# EAGLE design busunit (EAGLE 8.0.2)
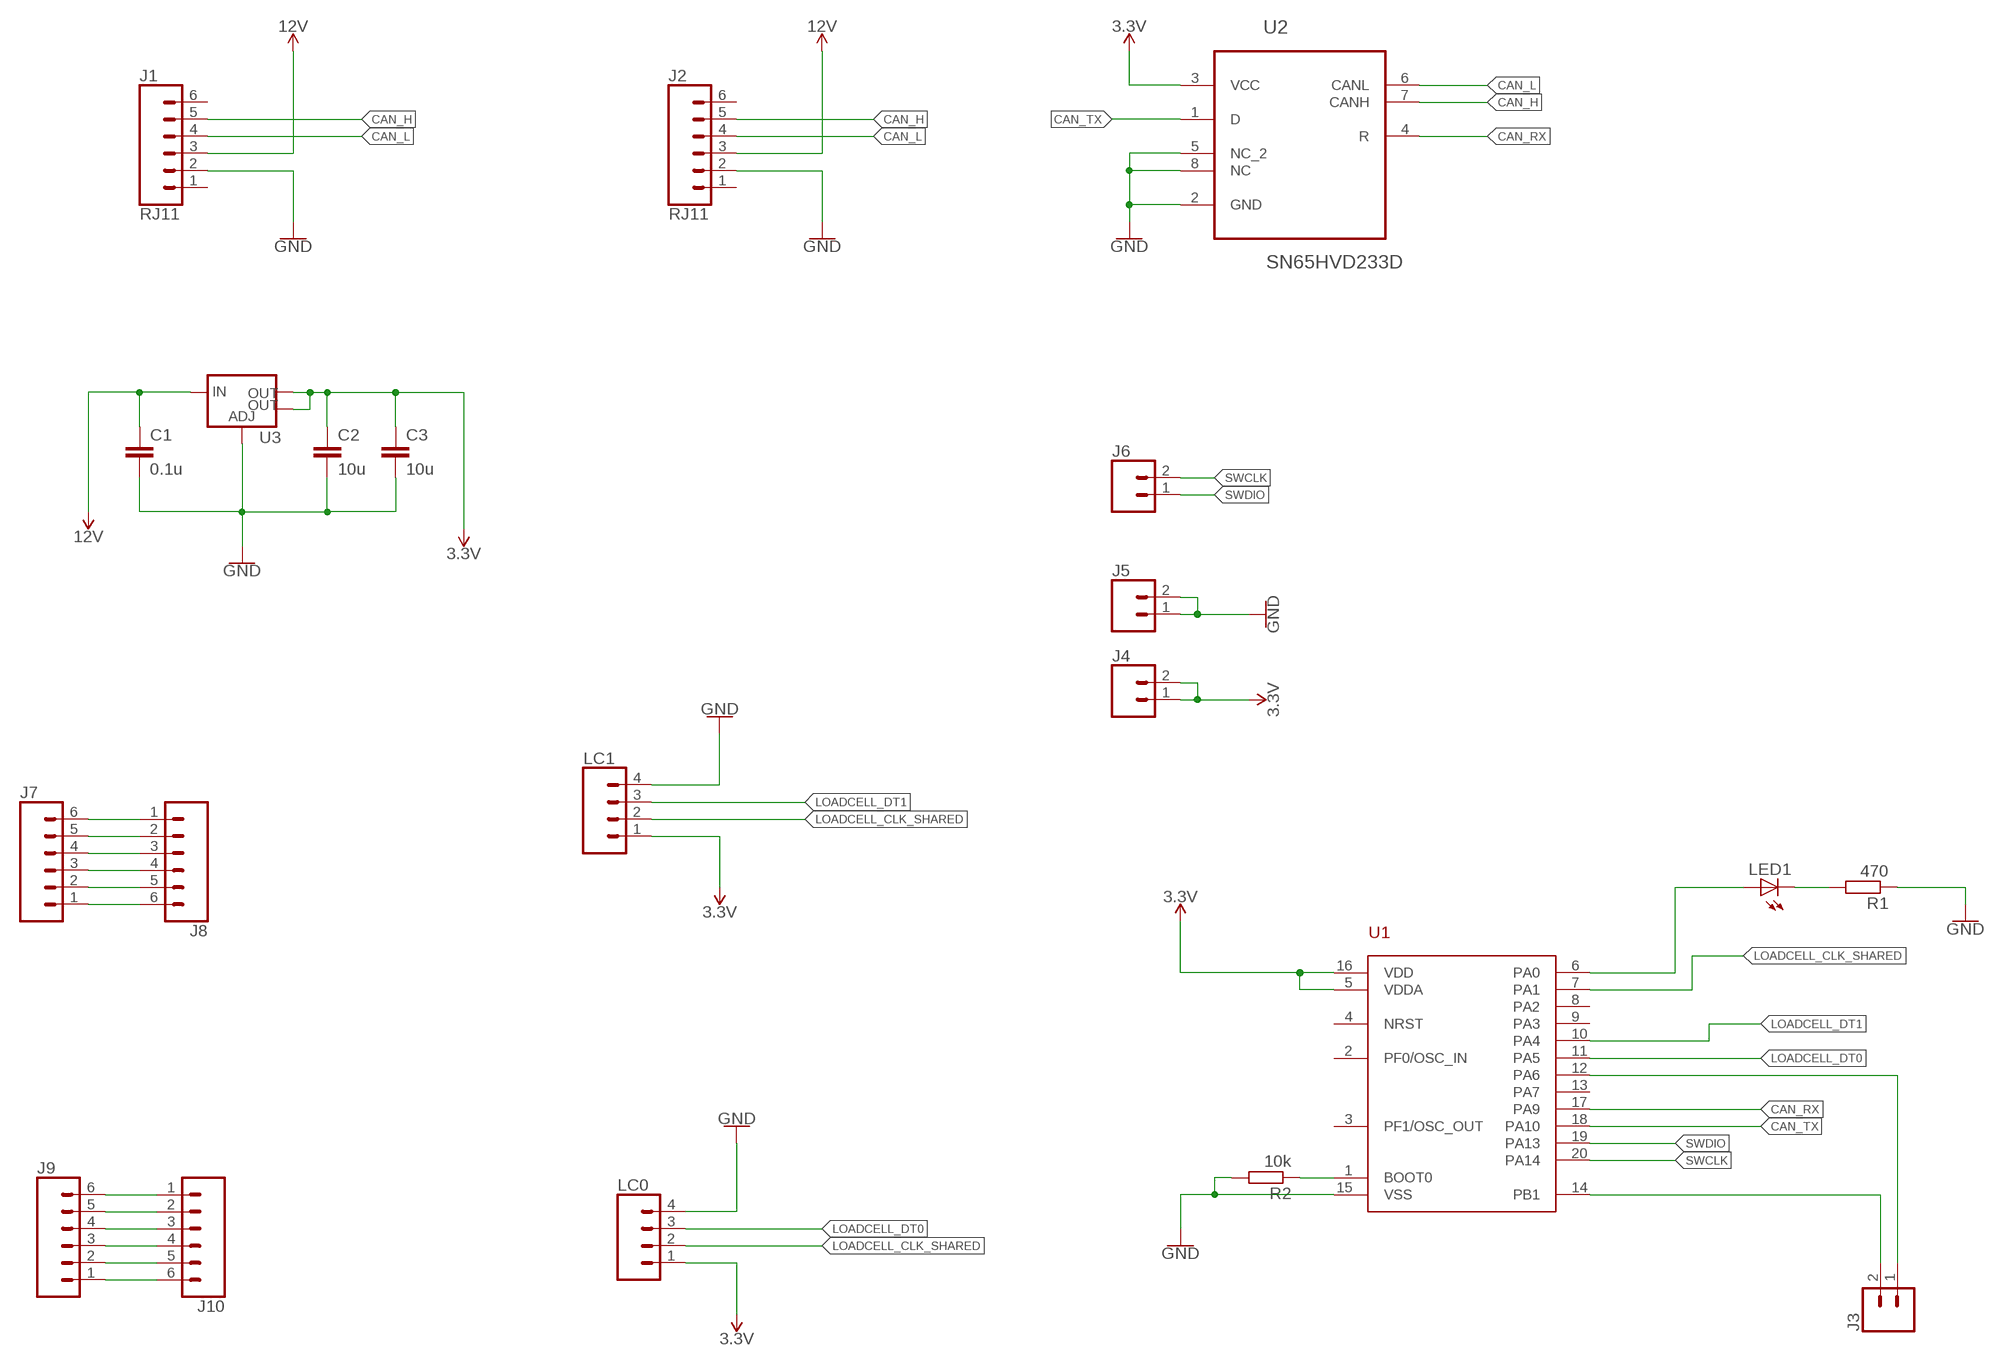
[diagram p0: schematic, sheet 1]

## Parts
C1  0.1u  C-EUC1206K  [C1206K]
C2  10u  C-EUC1206K  [C1206K]
C3  10u  C-EUC1206K  [C1206K]
J1  RJ11  RJ11-6  [RJ11-6]
J2  RJ11  RJ11-6  [RJ11-6]
J3  CONN_02  [1X02]
J4  CONN_02  [1X02]
J5  CONN_02  [1X02]
J6  CONN_02  [1X02]
J7  CONN_06SILK_FEMALE_PTH  [1X06]
J8  CONN_06SILK_FEMALE_PTH  [1X06]
J9  CONN_06SILK_FEMALE_PTH  [1X06]
J10  CONN_06SILK_FEMALE_PTH  [1X06]
LC0  CONN_04  [1X04]
LC1  CONN_04  [1X04]
LED1  LEDCHIPLED_1206  [CHIPLED_1206]
R1  470  R-EU_R1206  [R1206]
R2  10k  R-EU_R1206  [R1206]
U1  STM32F030F4  [TSSOP20]
U2  SN65HVD233D  [SOIC127P600X175-8N]
U3  V_REG_LM1117SOT223  [SOT223]

## Nets
3.3V: C2.1 C3.1 J4.1 J4.2 LC0.1 LC1.1 U1.5(VDDA) U1.16(VDD) U2.3(VCC) U3.2(OUT) U3.4(OUT)
12V: C1.1 J1.3 J2.3 U3.3(IN)
CAN_H: J1.5 J2.5 U2.7(CANH)
CAN_L: J1.4 J2.4 U2.6(CANL)
CAN_RX: U1.17(PA9) U2.4(R)
CAN_TX: U1.18(PA10) U2.1(D)
GND: C1.2 C2.2 C3.2 J1.2 J2.2 J5.1 J5.2 LC0.4 LC1.4 R1.1 R2.2 U1.15(VSS) U2.2(GND) U2.5(NC_2) U2.8(NC) U3.1(ADJ)
LED: LED1.A U1.6(PA0)
LOADCELL_CLK_SHARED: LC0.2 LC1.2 U1.7(PA1)
LOADCELL_DT0: LC0.3 U1.11(PA5)
LOADCELL_DT1: LC1.3 U1.10(PA4)
N$2: R2.1 U1.1(BOOT0)
N$3: LED1.C R1.2
N$4: J9.6 J10.1
N$5: J9.5 J10.2
N$6: J9.4 J10.3
N$7: J9.3 J10.4
N$8: J9.2 J10.5
N$9: J9.1 J10.6
N$10: J7.1 J8.6
N$11: J7.2 J8.5
N$12: J7.3 J8.4
N$13: J7.4 J8.3
N$14: J7.5 J8.2
N$15: J7.6 J8.1
PA6: J3.1 U1.12(PA6)
PB1: J3.2 U1.14(PB1)
SWCLK: J6.2 U1.20(PA14)
SWDIO: J6.1 U1.19(PA13)
Unconnected: J1.1 J1.6 J2.1 J2.6 U1.2(PF0/OSC_IN) U1.3(PF1/OSC_OUT) U1.4(NRST) U1.8(PA2) U1.9(PA3) U1.13(PA7)

## Library data of the parts
C1-C3 = rcl:C-EU: CAPACITOR, European symbol
J1 J2 = SparkFun-Connectors:RJ11-6: RJ11 Jack - 6 pin Commonly found on CAT3 devices and some Microchip programmers. Here is the connector we sell at SparkFun: RJ11 6-Pin Connector <https://www.sparkfun.com/products/132> (PRT-00132) Datasheet <http://www.sparkfun.com/datasheets/Prototyping/Connectors/RJ11-Datasheet.pdf> It is used on this SparkFun product: SparkFun Weather Shield <https://www.sparkfun.com/products/12081> (DEV-12081) Weather Meters <https://www.sparkfun.com/products/8942> (SEN-08942); PROD_ID: CONN-08590; SF_ID: PRT-00132
J3-J6 = SparkFun-Connectors:CONN_02: Multi connection point. Often used as Generic Header-pin footprint for 0.1 inch spaced/style header connections On any of the 0.1 inch spaced packages, you can populate with these: Break Away Headers - Straight <https://www.sparkfun.com/products/116> (PRT-00116) Break Away Male Headers - Right Angle <https://www.sparkfun.com/products/553> (PRT-00553) Female Headers <https://www.sparkfun.com/products/115> (PRT-00115) Break Away Headers - Machine Pin <https://www.sparkfun.com/products/117> (PRT-00117) Break Away Female Headers - Swiss Machine Pin <https://www.sparkfun.com/products/743> (PRT-00743) For SCREWTERMINALS and SPRING TERMINALS visit here: Screw Terimnals on SparkFun.com <https://www.sparkfun.com/search/results?term=Screw+Terminals> (5mm/3.5mm/2.54mm spacing) This device is also useful as a general connection point to wire up your design to another part of your project. Our various solder wires solder well into these plated through hole pads. Hook-Up Wire - Assortment (Stranded, 22 AWG) <https://www.sparkfun.com/products/11375> (PRT-11375) Hook-Up Wire - Assortment (Solid Core, 22 AWG) <https://www.sparkfun.com/products/11367> (PRT-11367) View the entire wire category on our website here <https://www.sparkfun.com/categories/141> Special notes: Molex polarized connector foot print use with: PRT-08233 with associated crimp pins and housings. 2.54_SCREWTERM for use with PRT-10571. 3.5mm Screw Terminal footprints for PRT-08084 5mm Screw Terminal footprints for use with PRT-08432
J7-J10 = SparkFun-Connectors:CONN_06: Multi connection point. Often used as Generic Header-pin footprint for 0.1 inch spaced/style header connections On any of the 0.1 inch spaced packages, you can populate with these: Break Away Headers - Straight <https://www.sparkfun.com/products/116> (PRT-00116) Break Away Male Headers - Right Angle <https://www.sparkfun.com/products/553> (PRT-00553) Female Headers <https://www.sparkfun.com/products/115> (PRT-00115) Break Away Headers - Machine Pin <https://www.sparkfun.com/products/117> (PRT-00117) Break Away Female Headers - Swiss Machine Pin <https://www.sparkfun.com/products/743> (PRT-00743) Arduino Stackable Header - 6 Pin <https://www.sparkfun.com/products/9280> (PRT-09280) For SCREWTERMINALS and SPRING TERMINALS visit here: Screw Terimnals on SparkFun.com <https://www.sparkfun.com/search/results?term=Screw+Terminals> (5mm/3.5mm/2.54mm spacing) This device is also useful as a general connection point to wire up your design to another part of your project. Our various solder wires solder well into these plated through hole pads. Hook-Up Wire - Assortment (Stranded, 22 AWG) <https://www.sparkfun.com/products/11375> (PRT-11375) Hook-Up Wire - Assortment (Solid Core, 22 AWG) <https://www.sparkfun.com/products/11367> (PRT-11367) View the entire wire category on our website here <https://www.sparkfun.com/categories/141>; PROD_ID: CONN-08437
LC0 LC1 = SparkFun-Connectors:CONN_04: Multi connection point. Often used as Generic Header-pin footprint for 0.1 inch spaced/style header connections On any of the 0.1 inch spaced packages, you can populate with these: Break Away Headers - Straight <https://www.sparkfun.com/products/116> (PRT-00116) Break Away Male Headers - Right Angle <https://www.sparkfun.com/products/553> (PRT-00553) Female Headers <https://www.sparkfun.com/products/115> (PRT-00115) Break Away Headers - Machine Pin <https://www.sparkfun.com/products/117> (PRT-00117) Break Away Female Headers - Swiss Machine Pin <https://www.sparkfun.com/products/743> (PRT-00743) For SCREWTERMINALS and SPRING TERMINALS visit here: Screw Terimnals on SparkFun.com <https://www.sparkfun.com/search/results?term=Screw+Terminals> (5mm/3.5mm/2.54mm spacing) This device is also useful as a general connection point to wire up your design to another part of your project. Our various solder wires solder well into these plated through hole pads. Hook-Up Wire - Assortment (Stranded, 22 AWG) <https://www.sparkfun.com/products/11375> (PRT-11375) Hook-Up Wire - Assortment (Solid Core, 22 AWG) <https://www.sparkfun.com/products/11367> (PRT-11367) View the entire wire category on our website here <https://www.sparkfun.com/categories/141> Special notes: Molex polarized connector foot print use with SKU : PRT-08231 with associated crimp pins and housings. 1MM SMD Version SKU: PRT-10208; PROD_ID: CONN-09696
LED1 = led:LED: LED OSRAM: - CHIPLED LG R971, LG N971, LY N971, LG Q971, LY Q971, LO R971, LY R971 LH N974, LH R974 LS Q976, LO Q976, LY Q976 LO Q996 - Hyper CHIPLED LW Q18S LB Q993, LB Q99A, LB R99A - SideLED LS A670, LO A670, LY A670, LG A670, LP A670 LB A673, LV A673, LT A673, LW A673 LH A674 LY A675 LS A676, LA A676, LO A676, LY A676, LW A676 LS A679, LY A679, LG A679 - Hyper Micro SIDELED® LS Y876, LA Y876, LO Y876, LY Y876 LT Y87S - SmartLED LW L88C, LW L88S LB L89C, LB L89S, LG L890 LS L89K, LO L89K, LY L89K LS L896, LA L896, LO L896, LY L896 - TOPLED LS T670, LO T670, LY T670, LG T670, LP T670 LSG T670, LSP T670, LSY T670, LOP T670, LYG T670 LG T671, LOG T671, LSG T671 LB T673, LV T673, LT T673, LW T673 LH T674 LS T676, LA T676, LO T676, LY T676, LB T676, LH T676, LSB T676, LW T676 LB T67C, LV T67C, LT T67C, LS T67K, LO T67K, LY T67K, LW E67C LS E67B, LA E67B, LO E67B, LY E67B, LB E67C, LV E67C, LT E67C LW T67C LS T679, LY T679, LG T679 LS T770, LO T770, LY T770, LG T770, LP T770 LB T773, LV T773, LT T773, LW T773 LH T774 LS E675, LA E675, LY E675, LS T675 LS T776, LA T776, LO T776, LY T776, LB T776 LHGB T686 LT T68C, LB T68C - Hyper Mini TOPLED® LB M676 - Mini TOPLED Santana® LG M470 LS M47K, LO M47K, LY M47K Source: http://www.osram.convergy.de LUXEON: - LUMILED® LXK2-PW12-R00, LXK2-PW12-S00, LXK2-PW14-U00, LXK2-PW14-V00 LXK2-PM12-R00, LXK2-PM12-S00, LXK2-PM14-U00 LXK2-PE12-Q00, LXK2-PE12-R00, LXK2-PE12-S00, LXK2-PE14-T00, LXK2-PE14-U00 LXK2-PB12-K00, LXK2-PB12-L00, LXK2-PB12-M00, LXK2-PB14-N00, LXK2-PB14-P00, LXK2-PB14-Q00 LXK2-PR12-L00, LXK2-PR12-M00, LXK2-PR14-Q00, LXK2-PR14-R00 LXK2-PD12-Q00, LXK2-PD12-R00, LXK2-PD12-S00 LXK2-PH12-R00, LXK2-PH12-S00 LXK2-PL12-P00, LXK2-PL12-Q00, LXK2-PL12-R00 Source: www.luxeon.com KINGBRIGHT: KA-3528ASYC Source: www.kingbright.com
R1 R2 = rcl:R-EU_: RESISTOR, European symbol
U1 = stm32f030f4:STM32F030F4
U2 = Texas Instruments_By_element14_Batch_1:SN65HVD233D: 3.3-V CAN TRANSCEIVERS; MPN: SN65HVD233D; OC_FARNELL: 1207268; OC_NEWARK: 54H4289; PACKAGE: SOIC-8; SUPPLIER: Texas Instruments
U3 = SparkFun-IC-Power:V_REG_LM1117: Voltage Regulator LM1117 Standard adjustable voltage regulator but in SMD form. Spark Fun Electronics SKU : COM-00595; PROD_ID: VREG-08170

## Board
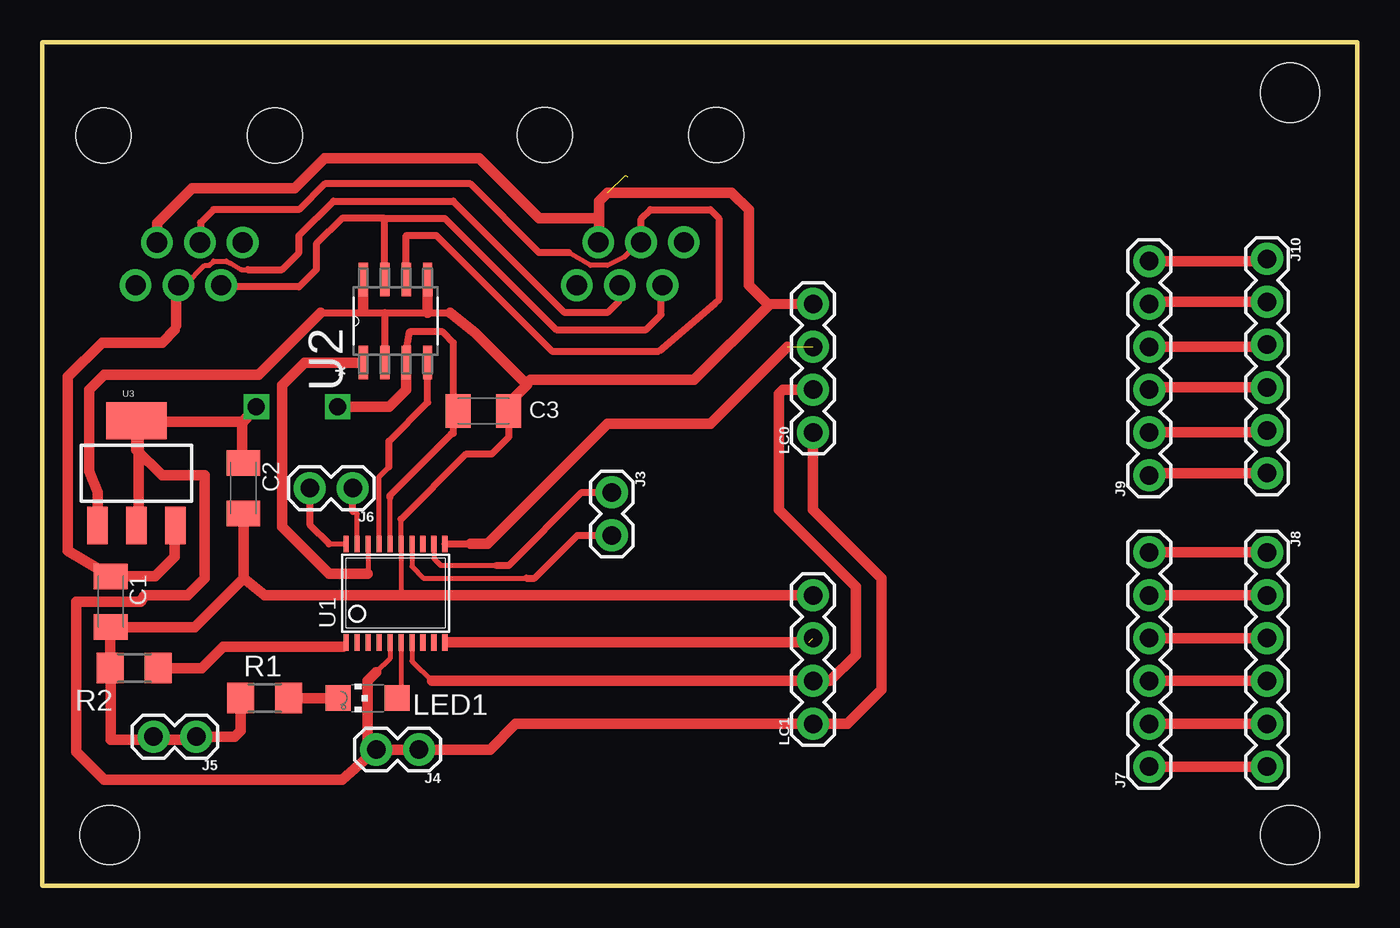
[diagram p1: board, top side]
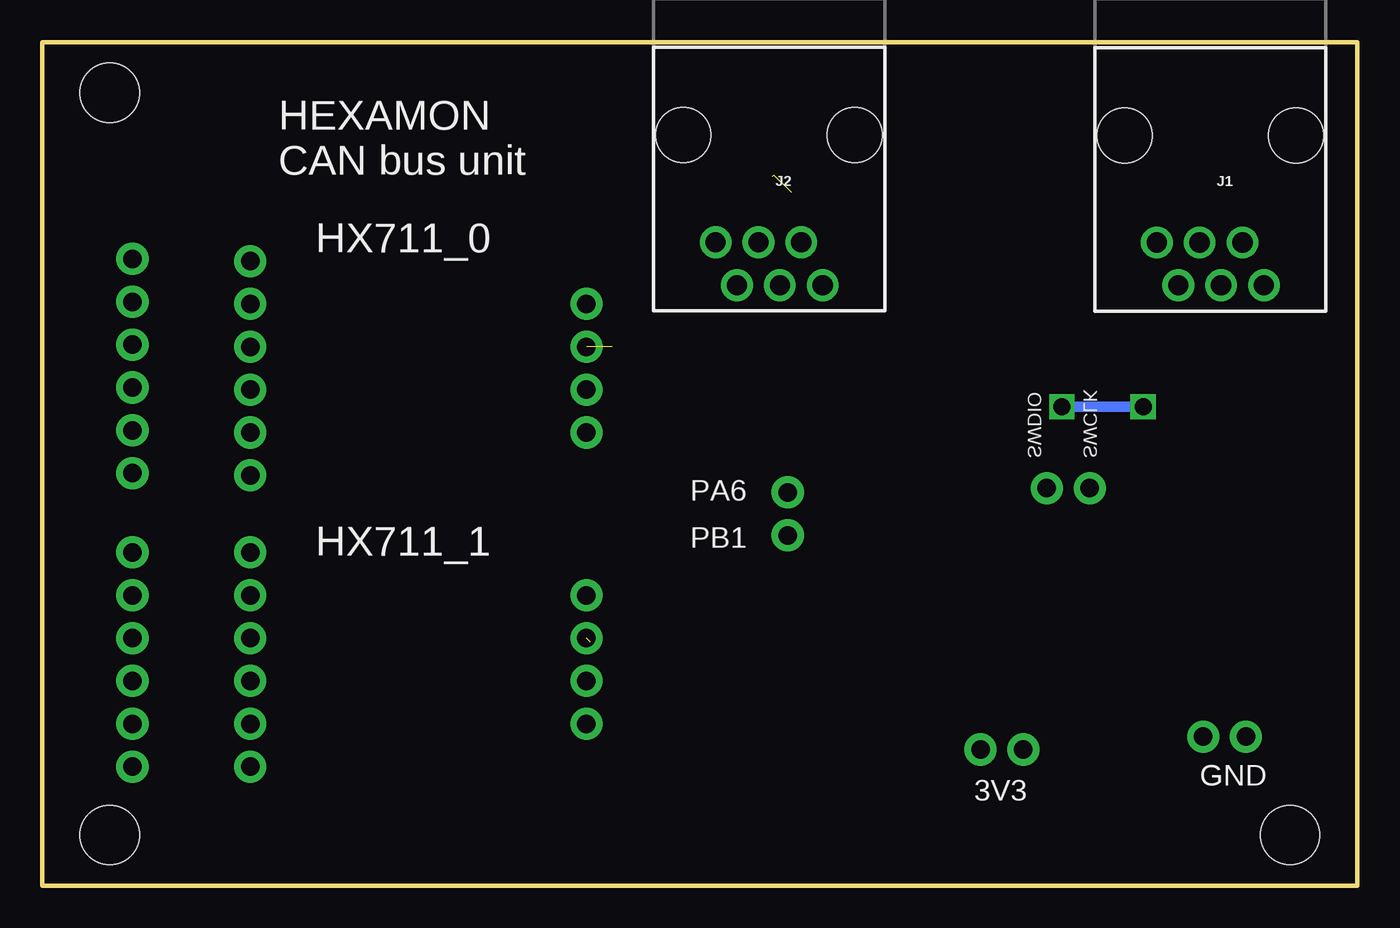
[diagram p2: board, bottom side, seen from below]

Size 78 x 50 mm. Coordinates in mm from the lower left corner, seen from the top.
Outline: 0,0 78,0 78,50 0,50 0,0
Copper layers (1*16): Top 0.035mm / dielectric 1.5mm / Bottom 0.035mm
Design rules "default": minimum track width 10mil, minimum drill 24mil, track to track 8mil, track to pad 8mil, pad to pad 8mil, via to via 8mil, smd to smd 8mil, copper to edge 40mil, drill to drill 8mil, minimum pad ring 10mil, minimum via ring 8mil, stop-mask expansion 4mil, vias tented up to drill 0mil, thermal gap 10mil
Holes 3.5 mm at 4,3 74,3 74,47

### Footprints (pad centres in the part's own frame; a part is rotated, then mirrored left to right if it is on the bottom)
C1206K = smd 1.5 x 2: 1 -1.5,0; 2 1.5,0
RJ11-6 = drill 1.2 pad 1.88: 1 -3.175,8.89; 2 -1.905,6.35; 3 -0.635,8.89; 4 0.635,6.35; 5 1.905,8.89; 6 3.175,6.35 | hole 3.25: -5.08,0; 5.08,0
1X02 = drill 1.1 pad 1.9: 1 0,0; 2 2.54,0
1X06 = drill 1.1 pad 1.9: 1 0,0; 2 2.54,0; 3 5.08,0; 4 7.62,0; 5 10.16,0; 6 12.7,0
1X04 = drill 1.1 pad 1.9: 1 0,0; 2 2.54,0; 3 5.08,0; 4 7.62,0
CHIPLED_1206 = smd 1.5 x 1.5: A 0,-1.75; C 0,1.75
R1206 = smd 1.6 x 1.803: 1 -1.422,0; 2 1.422,0
TSSOP20 = smd 0.305 x 0.991: 1 -2.925,-2.918; 2 -2.275,-2.918; 3 -1.625,-2.918; 4 -0.975,-2.918; 5 -0.325,-2.918; 6 0.325,-2.918; 7 0.975,-2.918; 8 1.625,-2.918; 9 2.275,-2.918; 10 2.925,-2.918; 11 2.925,2.918; 12 2.275,2.918; 13 1.625,2.918; 14 0.975,2.918; 15 0.325,2.918; 16 -0.325,2.918; 17 -0.975,2.918; 18 -1.625,2.918; 19 -2.275,2.918; 20 -2.925,2.918
SOIC127P600X175-8N = smd 1.981 x 0.559: 1 -2.464,1.905; 2 -2.464,0.635; 3 -2.464,-0.635; 4 -2.464,-1.905; 5 2.464,-1.905; 6 2.464,-0.635; 7 2.464,0.635; 8 2.464,1.905
SOT223 = smd 1.219 x 2.235: 1 -2.311,-3.099; 2 0,-3.099; 3 2.311,-3.099 | smd 3.6 x 2.2: 4 0,3.099

### Placement (x,y rotation side)
C1  4.06,16.83 270 top
C2  11.94,23.56 270 top
C3  26.16,28.13 0 top
J1  8.72,44.48 180 bottom
J2  34.88,44.48 180 bottom
J3  33.78,23.3 270 top
J4  22.35,8.06 180 top
J5  9.14,8.83 180 top
J6  18.41,23.56 180 top
J7  65.65,7.05 90 top
J8  72.64,19.75 270 top
J9  65.65,24.32 90 top
J10  72.64,37.15 270 top
LC0  45.72,26.86 90 top
LC1  45.72,9.59 90 top
LED1  19.3,11.11 90 top
R1  13.21,11.11 0 top
R2  5.46,12.89 180 top
U1  20.95,17.34 0 top
U2  20.95,33.46 90 top
U3  5.59,24.45 0 top

### Tracks (layer width: path | path; a pad name or v marks a point on that pad's centre or on a via)
3.3V  (via drill 1)
  Top 0.254: U2.3 21.59,31.62 | 20.64,20.51 U1.16 | 11.87,25.08 C2.1 | 5.71,21.46 U3.2 | 5.71,27.5 U3.4 | 20.64,14.16 U1.5 | 20,8.13 J4.2 19.68,7.81
  Top 0.305: U1.5 20.63,13.45 19.81,12.64 | U1.16 20.63,23
  Top 0.406: 21.59,31.62 21.78,32.83 23.75,32.83 24.38,32.19 24.38,28.36 C3.1 24.38,27.9 24.38,26.81 24.25,26.76 20.63,23.14 20.63,23
  Top 0.61: 11.87,25.08 11.87,27.43 | 5.71,21.46 5.71,27.5 11.87,27.5 11.87,27.43 | 19.81,12.64 19.3,12.13 19.3,8.57 J4.2 | J4.2 J4.1 26.56,8.06 28.08,9.59 LC1.1 47.75,9.59 49.78,11.62 49.78,18.22 45.72,22.29 LC0.1 | U3.4 5.59,25.84 7.11,24.32 9.65,24.32 9.65,18.22 8.64,17.21 6.1,17.21 5.84,16.83 2.03,16.83 2.03,7.94 3.68,6.29 17.78,6.29 J4.2 | 11.87,27.43 v12.7,28.38 | v17.53,28.38 20.57,28.38 21.59,29.4 U2.3
  Bottom 0.61: v12.7,28.38 v17.53,28.38
12V
  Top 0.254: U3.3 7.62,21.14 | 7.94,35.43 J1.3 | 7.94,33.21 7.87,32.96
  Top 0.305: J1.3 8.47,35.59 9.65,36.77 9.91,36.77 10.16,37.02 10.92,37.02 11.18,36.89 11.81,36.51 12.19,36.51
  Top 0.406: 12.19,36.51 14.22,36.51 15.24,37.53 15.24,38.54 17.27,40.58 24.38,40.58 30.99,33.97 33.53,33.97 34.2,34.64 J2.3
  Top 0.61: U3.3 7.87,21.32 7.87,19.49 6.71,18.33 C1.1 1.52,19.85 1.52,30.16 3.56,32.19 7.11,32.19 7.87,32.96 | 7.94,33.21 7.94,35.43
CAN_H
  Top 0.406: 20.32,39.56 23.88,39.56 30.48,32.96 35.81,32.96 36.7,33.84 36.7,35.51 J2.5 | 20.32,39.56 17.78,39.56 16.26,38.04 16.26,36.51 15.24,35.5 10.71,35.5 J1.5 | U2.7 20.32,39.56
CAN_L
  Top 0.305: J2.4 35,37.73 34.54,37.27 33.53,36.77 32.51,36.77 31.24,37.53
  Top 0.406: U2.6 21.59,38.54 23.37,38.54 30.23,31.69 36.58,31.69 39.88,34.48 40.13,34.73 40.13,39.56 39.62,40.07 36.07,40.07 35.52,39.52 J2.4 | 31.24,37.53 29.46,37.53 25.4,41.59 16.76,41.59 15.24,40.07 10.16,40.07 9.4,39.31 9.4,38.17 J1.4
CAN_RX
  Top 0.254: 20,20.19 U1.17
  Top 0.305: U1.17 19.98,24.23 20.57,24.83
  Top 0.406: 20.57,24.83 20.57,26.35 22.86,28.64 U2.4
CAN_TX
  Top 0.254: 19.37,20.51 U1.18
  Top 0.305: U1.18 19.33,18.5 19.3,18.48
  Top 0.61: U2.1 15.57,31 14.22,29.65 14.22,21.27 17.02,18.48 19.3,18.48
GND  (2 unrouted)
  Top 0.254: U3.1 3.17,21.46 | 9.21,8.64 J5.1 8.89,8.64 | 3.49,12.89 R2.2 4.06,12.89 | 6.35,8.64 J5.2 6.67,8.64 | 21.27,20.51 U1.15
  Top 0.305: 21.34,17.21 21.28,17.26 U1.15 21.28,21.72
  Top 0.406: 20.32,33.97 U2.2 | 20.32,33.97 22.86,33.97 24.18,33.97 | 28.76,29.68 28.96,29.97 | 18.8,33.97 20.32,33.97 | 16.51,33.97 18.8,33.97 | 3.3,21.37 U3.1 | 18.8,33.97 19.05,34.23 | 32.89,39.56 33.02,39.69 | 21.28,21.72 25.15,25.59 26.67,25.59 27.69,26.61 27.69,28.11 C3.2
  Top 0.61: 28.96,29.97 38.67,29.97 43.05,34.35 43.04,34.46 | 43.04,34.46 LC0.4 | 4.06,12.89 4.06,8.64 6.35,8.64 | 6.67,8.64 8.89,8.64 | R2.2 4.04,15.33 C1.2 9.04,15.33 11.94,18.22 | 11.94,18.22 C2.2 | LC1.4 21.34,17.21 13.21,17.21 11.94,18.22 | 3.3,21.37 3.3,23.3 2.79,24.57 2.79,29.4 3.68,30.27 12.57,30.29 12.83,30.29 16.51,33.97 | 27.66,28.08 C3.2 27.71,28.64 28.76,29.68 25.7,32.73 24.18,33.97 | J2.2 33.02,38.92 33.02,39.69 33.02,40.58 33.53,41.08 40.89,41.08 41.91,40.07 41.91,35.59 43.04,34.46 | J1.2 6.81,39.26 8.89,41.34 14.99,41.34 16.76,43.12 25.91,43.12 29.46,39.56 32.89,39.56 | 19.05,34.23 U2.8 | 22.86,33.97 U2.5 | R1.1 11.79,9.18 11.43,8.83 J5.1
LED
  Top 0.254: 21.27,14.16 U1.6
  Top 0.305: U1.6 21.28,11.34 LED1.A
LOADCELL_CLK_SHARED
  Top 0.254: 21.91,14.16 U1.7 | 45.72,12.26 LC1.2
  Top 0.305: U1.7 21.93,13.31 23.11,12.13
  Top 0.61: 23.11,12.13 LC1.2 46.74,12.13 48.26,13.65 48.26,17.72 43.69,22.29 43.69,29.15 | 43.69,29.15 43.81,29.27 | LC0.2 43.94,29.4 43.69,29.15
LOADCELL_DT0  (1 unrouted)
  Top 0.406: U1.11 25.4,20.25 25.4,20.26
  Top 0.61: 25.4,20.26 26.42,20.26 33.53,27.37 39.62,27.37 44.2,31.94
LOADCELL_DT1  (1 unrouted)
  Top 0.305: U1.10 24.38,14.42 24.13,14.41
  Top 0.61: 24.13,14.41 45.47,14.41
N$2
  Top 0.254: 17.84,14.16 U1.1
  Top 0.61: 17.84,14.16 10.73,14.16 9.46,12.89 R2.1
N$3
  Top 0.61: R1.2 LED1.C
N$4
  Top 0.61: J9.6 72.52,37.02 J10.1
N$5
  Top 0.61: J10.2 65.78,34.61 J9.5
N$6
  Top 0.61: J9.4 72.52,31.94 J10.3
N$7
  Top 0.61: J10.4 65.78,29.53 J9.3
N$8
  Top 0.61: J9.2 72.52,26.86 J10.5
N$9
  Top 0.61: J10.6 65.78,24.45 J9.1
N$10
  Top 0.61: J8.6 J7.1
N$11
  Top 0.61: J7.2 J8.5
N$12
  Top 0.61: J8.4 J7.3
N$13
  Top 0.61: J7.4 J8.3
N$14
  Top 0.61: J8.2 J7.5
N$15
  Top 0.61: J7.6 J8.1
PA6
  Top 0.305: U1.12 23.23,19.38 23.62,18.99 26.92,18.99
  Top 0.406: 26.92,18.99 27.69,18.99 32,23.3 J3.1
PB1
  Top 0.305: U1.14 21.93,18.9 22.61,18.22 28.7,18.22
  Top 0.406: 28.7,18.22 29.21,18.22 31.75,20.76 J3.2
SWCLK
  Top 0.305: 17.02,20.26 U1.20
  Top 0.406: J6.2 15.88,21.4 17.02,20.26
SWDIO
  Top 0.305: U1.19 18.68,22.02 18.41,22.16
  Top 0.406: 18.41,22.16 J6.1

### Text on the board
bPlace: HEXAMON / CAN bus unit | HX711_0 | SWCLK | SWDIO | PA6 | PB1 | HX711_1 | GND | 3V3
tDocu: HX711 small / modules comes here | HX711 small / modules comes here